# Altium schematic sheet POWER.SchDoc
size A4
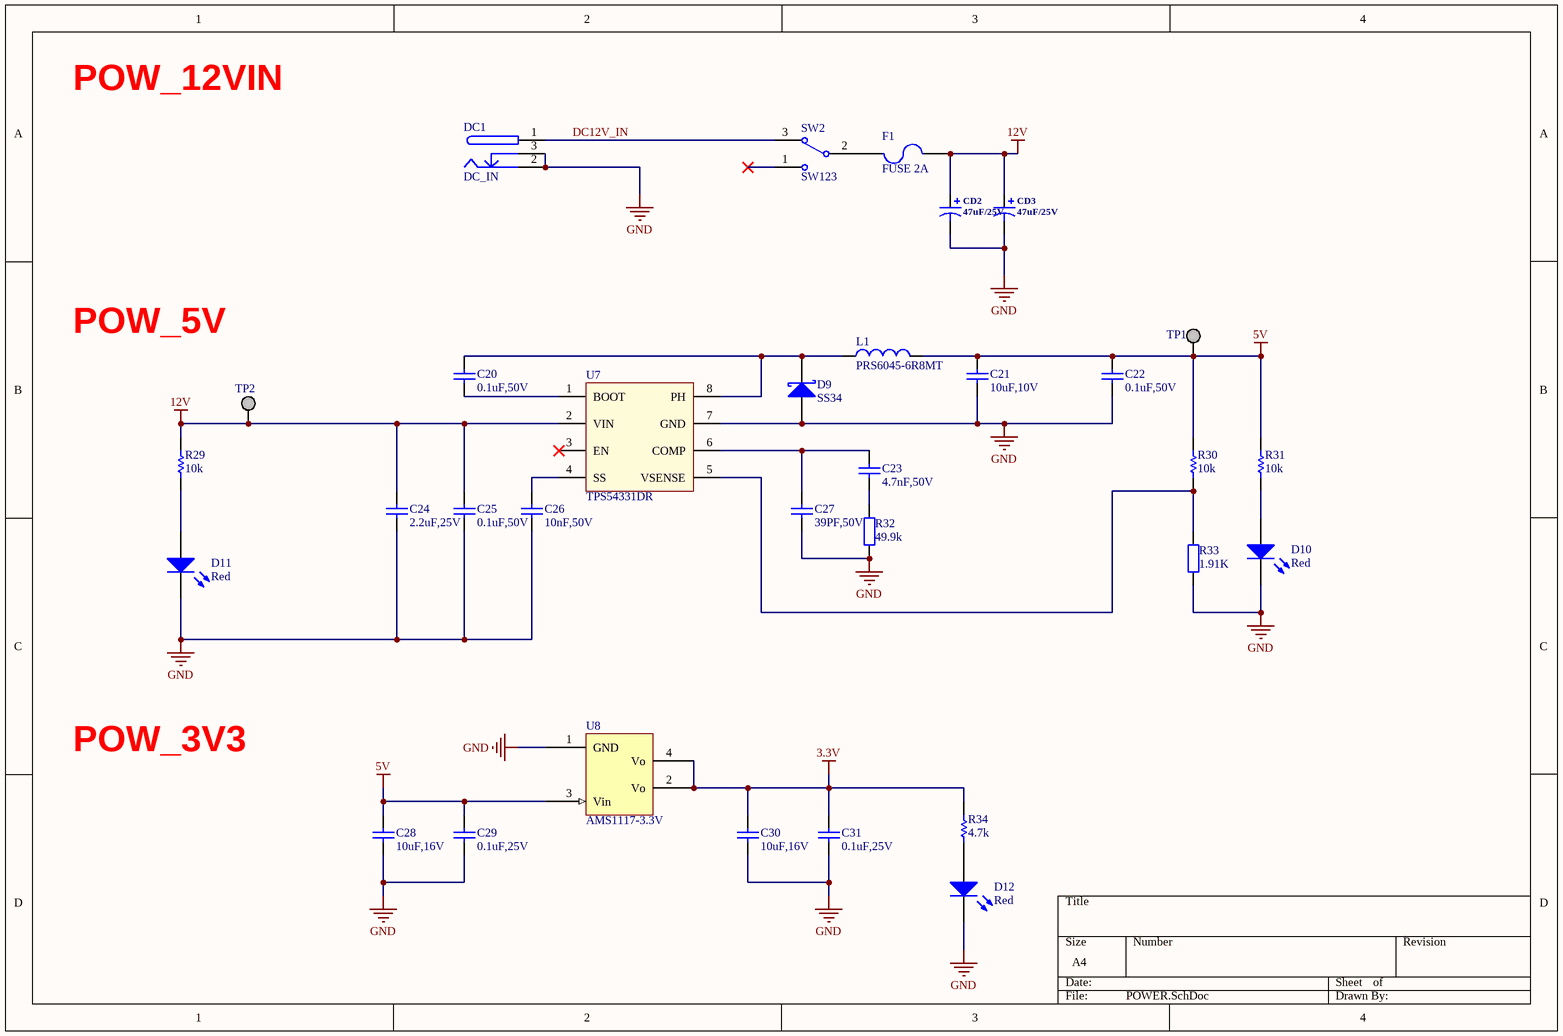
[diagram p0: POWER.SchDoc]

## Parts
C20  value 0.1uF,50V  [0603_C]  (hidden comment: Cap)
C21  value 10uF,10V  [0603_C]  (hidden comment: Cap)
C22  value 0.1uF,50V  [0603_C]  (hidden comment: Cap)
C23  value 4.7nF,50V  [0603_C]  (hidden comment: Cap)
C24  value 2.2uF,25V  [0603_C]  (hidden comment: Cap)
C25  value 0.1uF,50V  [0603_C]  (hidden comment: Cap)
C26  value 10nF,50V  [0603_C]  (hidden comment: Cap)
C27  value 39PF,50V  [0603_C]  (hidden comment: Cap)
C28  value 10uF,16V  [0603_C]  (hidden comment: Cap)
C29  value 0.1uF,25V  [0603_C]  (hidden comment: Cap)
C30  value 10uF,16V  [0603_C]  (hidden comment: Cap)
C31  value 0.1uF,25V  [0603_C]  (hidden comment: Cap)
CD2  47uF/25V  [CD7343]
CD3  47uF/25V  [CD7343]
D9  value SS34  [DO-214AC]  (hidden comment: Diode Schottky)
D10  value Red  [0603_LED]  (hidden comment: LED)
D11  value Red  [0603_LED]  (hidden comment: LED)
D12  value Red  [0603_LED]  (hidden comment: LED)
DC1  DC_IN  [PJ-058A]
F1  FUSE 2A  [1206_FUSE]
L1  value PRS6045-6R8MT  [IND-SMD_L5.8-W5.2]  (hidden comment: Inductors)
R29  value 10k  [0603_R]  (hidden comment: Res_5%)
R30  value 10k  [0603_R]  (hidden comment: Res_5%)
R31  value 10k  [0603_R]  (hidden comment: Res_5%)
R32  value 49.9k  [0603_R]  (hidden comment: Res)
R33  value 1.91K  [0603_R]  (hidden comment: Res)
R34  value 4.7k  [0603_R]  (hidden comment: Res_5%)
SW2  SW123  [SW-TH_SS-12D10L9]
TP1  TP  [TP_H]  (value not drawn)  (no BOM)
TP2  TP  [TP_H]  (value not drawn)  (no BOM)
U7  TPS54331DR  [SOIC8]
U8  value AMS1117-3.3V  [SOT223]  (hidden comment: AMS1117)

## Nets
3.3V: C30.2 C31.2 R34.2 U8.2(Vo) U8.4(Vo)
5V: C21.2 C22.2 C28.2 C29.2 L1.2 R30.2 R31.2 TP1.1 U8.3(Vin)
12V: C24.2 C25.2 CD2.1 CD3.1 F1.1 R29.2 TP2.1 U7.2(VIN)
GND: C21.1 C22.1 C24.1 C25.1 C26.2 C27.1 C28.1 C29.1 C30.1 C31.1 CD2.2 CD3.2 D9.1(A) D10.2(K) D11.2(K) D12.2(K) DC1.2 DC1.3 R32.1 R33.1 U7.7(GND) U8.1(GND)
DC12V_IN: DC1.1 SW2.3
NetC20_1: C20.1 U7.1(BOOT)
NetC20_2: C20.2 D9.2(K) L1.1 U7.8(PH)
NetC23_1: C23.1 R32.2
NetC23_2: C23.2 C27.2 U7.6(COMP)
NetC26_1: C26.1 U7.4(SS)
NetD10_1: D10.1(A) R31.1
NetD11_1: D11.1(A) R29.1
NetD12_1: D12.1(A) R34.1
NetF1_2: F1.2 SW2.2
NetR30_1: R30.1 R33.2 U7.5(VSENSE)

Not connected (* = marked no-connect by the designer): SW2 1*; U7 3(EN)*

## Notes on the sheet
- POW_12VIN
- POW_5V
- POW_3V3

## Library data of the parts
C20 C22 C25 = T_Cap_0603_0.1uF_50V_Y5V: 贴片电容; Part Typer: Y5V; Solder: SMD; Withstand Voltage: 50V; Tolerance: 20%; Schematic Path: X:\Database\Schematic Library.Schlib; Part Number: T_Cap_0603_0.1uF_50V_Y5V; LibRef: T_Cap_0603_0.1uF_50V_Y5V
C21 = T_Cap_0603_22uF_10V_X5R: 贴片电容; Part Typer: X5R; Solder: SMD; Withstand Voltage: 10V; Tolerance: 20%; Schematic Path: X:\Database\Schematic Library.Schlib; Part Number: T_Cap_0603_22uF_10V_X5R; LibRef: T_Cap_0603_22uF_10V_X5R
C23 = T_Cap_0603_4.7nF_50V_X7R: 贴片电容; Part Typer: X7R; Solder: SMD; Withstand Voltage: 50V; Tolerance: 10%; Schematic Path: X:\Database\Schematic Library.Schlib; Part Number: T_Cap_0603_4.7nF_50V_X7R; LibRef: T_Cap_0603_4.7nF_50V_X7R
C24 = T_Cap_0603_2.2uF_25V_Y5V: 贴片电容; Part Typer: Y5V; Solder: SMD; Withstand Voltage: 25V; Tolerance: 20%; Schematic Path: X:\Database\Schematic Library.Schlib; Part Number: T_Cap_0603_2.2uF_25V_Y5V; LibRef: T_Cap_0603_2.2uF_25V_Y5V
C26 = T_Cap_0603_10nF_50V_X7R: 贴片电容; Part Typer: X7R; Solder: SMD; Withstand Voltage: 50V; Tolerance: 10%; Schematic Path: X:\Database\Schematic Library.Schlib; Part Number: T_Cap_0603_10nF_50V_X7R; LibRef: T_Cap_0603_10nF_50V_X7R
C27 = T_Cap_0603_39PF_50V_C0G: 贴片电容; Part Typer: C0G; Solder: SMD; Withstand Voltage: 50V; Tolerance: 5%; Schematic Path: X:\Database\Schematic Library.Schlib; Part Number: T_Cap_0603_39PF_50V_C0G; LibRef: T_Cap_0603_39PF_50V_C0G
C28 C30 = T_Cap_0603_10uF_16V_X5R: 贴片电容; Part Typer: X5R; Solder: SMD; Withstand Voltage: 16V; Tolerance: 10%; Schematic Path: X:\Database\Schematic Library.Schlib; Part Number: T_Cap_0603_10uF_16V_X5R; LibRef: T_Cap_0603_10uF_16V_X5R
C29 C31 = T_Cap_0603_0.1uF_25V_X5R: 贴片电容; Part Typer: X5R; Solder: SMD; Withstand Voltage: 25V; Tolerance: 10%; Schematic Path: X:\Database\Schematic Library.Schlib; Part Number: T_Cap_0603_0.1uF_25V_X5R; LibRef: T_Cap_0603_0.1uF_25V_X5R
CD2 CD3 = C-100: 钽电容,Tantalum Capacitors,47uF/16V,3.5*2.8; Published: 8-Jun-2000; LatestRevisionDate: 17-Jul-2002; LatestRevisionNote: Re-released for DXP Platform.; PackageReference: POLAR0.8; Publisher: Altium Limited
D9 = T_SS34: 肖特基二极管; Part Number: T_SS34; Solder: SMD; Schematic Path: X:\Database\Schematic Library.Schlib; LibRef: T_SS34
D10-D12 = T_LED_Red_0805: 红色LED灯; Solder: SMD; Schematic Path: X:\Database\Schematic Library.Schlib; Part Number: T_LED_Red_0805; LibRef: T_LED_Red_0805
DC1 = DC_IN: DC插座; Supplier: *; SupplierPartNumber: *
F1 = Fuse 2: Fuse; Published: 8-Jun-2000; LatestRevisionDate: 17-Jul-2002; LatestRevisionNote: Re-released for DXP Platform.; PackageReference: PIN-W2/E2.8; Publisher: Altium Limited
L1 = T_PRS6045-6R8MT: 贴片电感; Solder: SMD; Tolerance: 20%; Rated Current: 3.8A; Schematic Path: X:\Database\Schematic Library.Schlib; Part Number: T_PRS6045-6R8MT; LibRef: T_PRS6045-6R8MT
R29-R31 R34 = T_Res_0603_10k_5%_1/10W: 贴片电阻; Solder: SMD; Power: 1/10W; Tolerance: 5%; Schematic Path: X:\Database\Schematic Library.Schlib; Part Number: T_Res_0603_10k_5%_1/10W; LibRef: T_Res_0603_10k_5%_1/10W
R32 = T_Res_0603_49.9k_1%_1/10W: 贴片电阻; Solder: SMD; Power: 1/10W; Tolerance: 1%; Schematic Path: X:\Database\Schematic Library.Schlib; Part Number: T_Res_0603_49.9k_1%_1/10W; LibRef: T_Res_0603_49.9k_1%_1/10W
R33 = T_Res_0603_1.91k_1%_1/10W: 贴片电阻; Solder: SMD; Power: 1/10W; Tolerance: 1%; Schematic Path: X:\Database\Schematic Library.Schlib; Part Number: T_Res_0603_1.91k_1%_1/10W; LibRef: T_Res_0603_1.91k_1%_1/10W
SW2 = SW123: C319011
TP1 TP2 = T_TestPoint_H: 测试点_过孔; Solder: DIP; Schematic Path: X:\Database\Schematic Library.Schlib; Part Number: T_TestPoint_H; LibRef: T_TestPoint_H
U7 = TPS54331: TI, 3A, 3.5-28V, Buck
U8 = T_AMS1117-3.3V: 电源芯片; Solder: SMD; Schematic Path: X:\Database\Schematic Library.Schlib; Part Number: T_AMS1117-3.3V; LibRef: T_AMS1117-3.3V; ComponentLink2Description: Datasheet; ComponentLink2URL: X:\Database\Datasheet\AMS1117.pdf